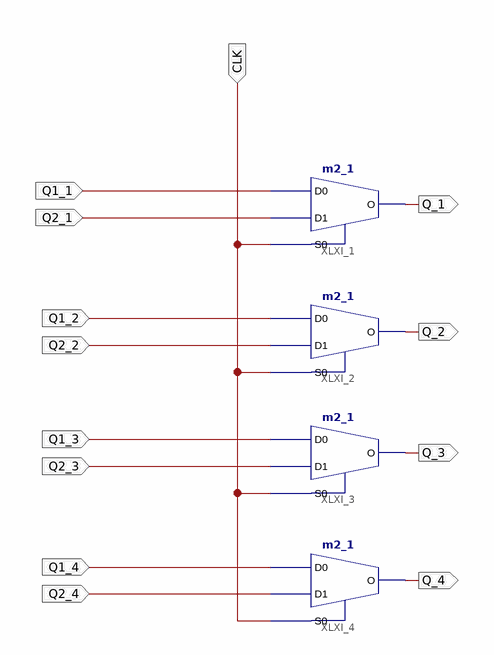
[diagram p0: schematic sheet 1]
// Xilinx ISE schematic selective2bcd.sch (spartan6) as structural Verilog: 4 symbols, 13 ports
module selective2bcd (
  input  CLK,
  input  Q1_4,
  input  Q2_4,
  input  Q2_3,
  input  Q1_3,
  input  Q2_2,
  input  Q1_2,
  input  Q2_1,
  input  Q1_1,
  output Q_1,
  output Q_2,
  output Q_3,
  output Q_4
);

  m2_1 XLXI_1 (.D0(Q1_1), .D1(Q2_1), .S0(CLK), .O(Q_1));
  m2_1 XLXI_2 (.D0(Q1_2), .D1(Q2_2), .S0(CLK), .O(Q_2));
  m2_1 XLXI_3 (.D0(Q1_3), .D1(Q2_3), .S0(CLK), .O(Q_3));
  m2_1 XLXI_4 (.D0(Q1_4), .D1(Q2_4), .S0(CLK), .O(Q_4));
endmodule
